# Altium project STM32MP15XXAD_1DDR3Lx16.PrjPcb
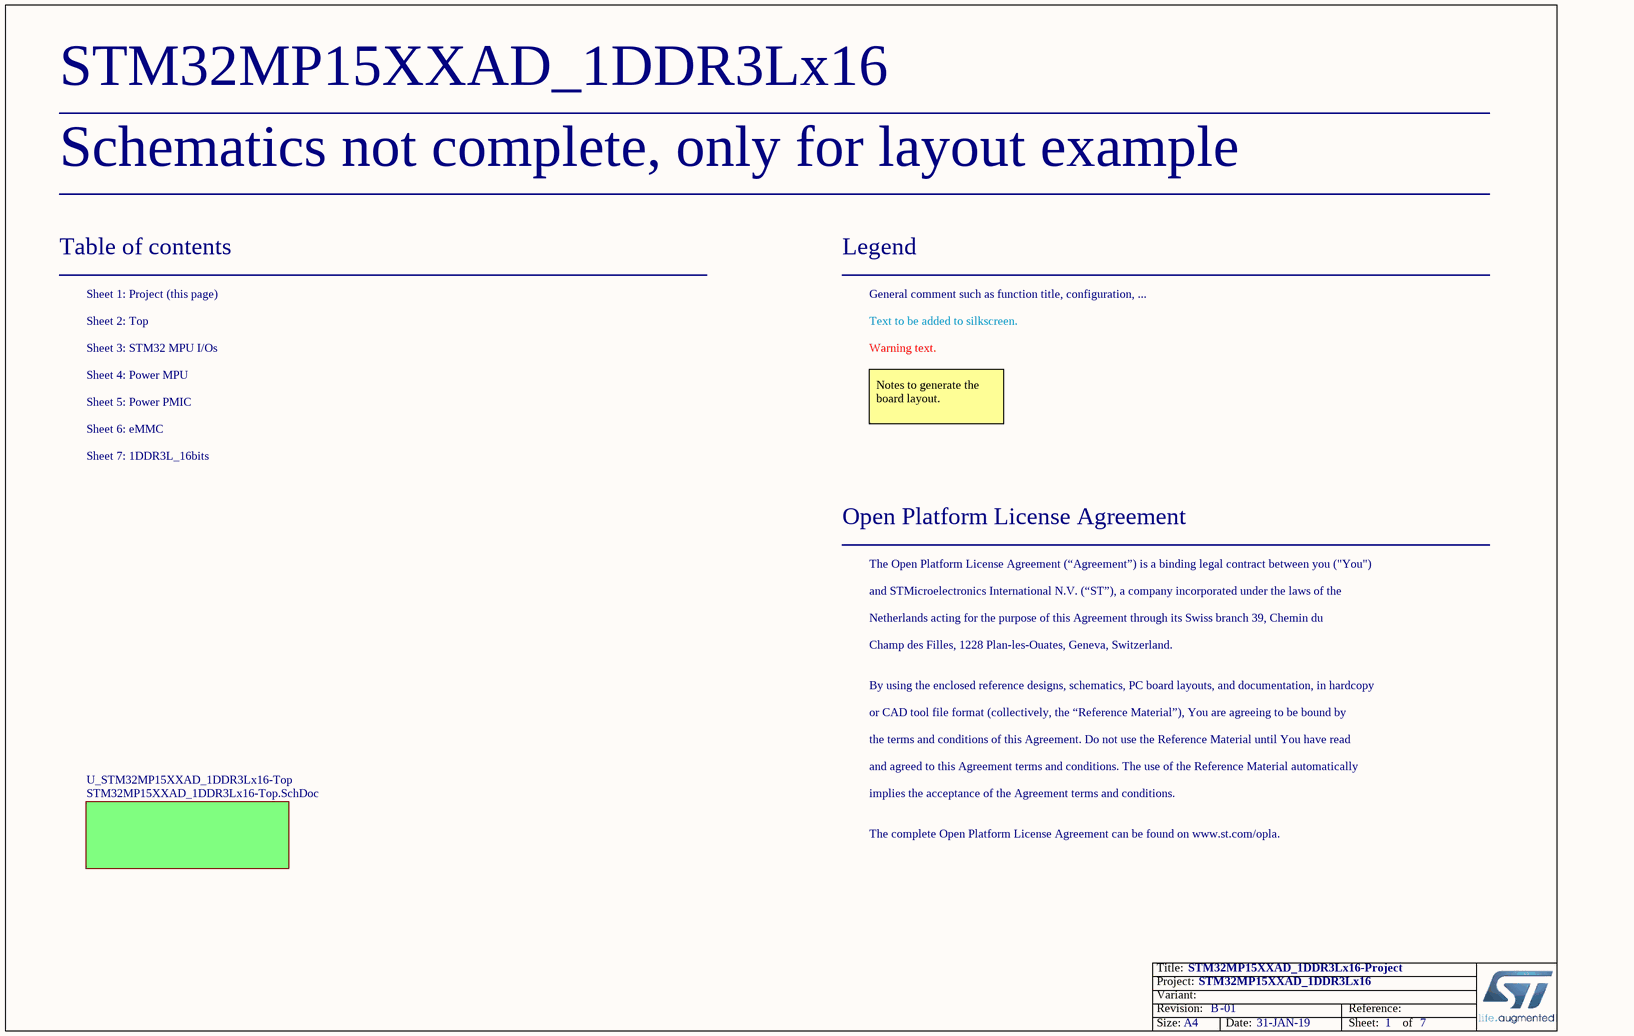
[diagram p0: STM32MP15XXAD_1DDR3Lx16-Project.SchDoc]
Board_Assembly_Revision: 01; Board_Document_Date: 31-JAN-19; Board_Name: STM32MP15XXAD_1DDR3Lx16; Board_PCB_Revision: B
7 sheets, 118 parts. Net scope: flat (ports and power ports of the same name join across sheets).
Board file: STM32MP15XXAD_1DDR3Lx16_B01.PcbDoc
Sheets:
  STM32MP15XXAD_1DDR3Lx16-Project.SchDoc
    U_STM32MP15XXAD_1DDR3Lx16-Top = STM32MP15XXAD_1DDR3Lx16-Top.SchDoc
      U_Power_PMIC = Power_PMIC.SchDoc
      U_Power_MPU = Power_MPU.SchDoc
      U_eMMC = eMMC.SchDoc
      U_1DDR3L_16bits = 1DDR3L_16bits.SchDoc
      U_STM32_MPU_IOs = STM32_MPU_IOs.SchDoc

## Sheet STM32MP15XXAD_1DDR3Lx16-Project.SchDoc: STM32MP15XXAD_1DDR3Lx16-Project
size A4; ApprovedBy: Not used; CheckedBy: Not used; Author: Not used; CompanyName: STMicroelectronics; DrawnBy: Not used; Engineer: Not used; Organization: Not used; Address1: Not used; Address2: Not used; Address3: Not used; Address4: Not used; DocumentNumber: Not used; Revision: Not used; SheetNumber: 1; SheetTotal: 7; CurrentTime: Not used; CurrentDate: Not used; Time: Not used; DocumentFullPathAndName: Not used; DocumentName: Not used; ModifiedDate: Not used; ImagePath: Not used; ProjectName: Not used; Application_BuildNumber: Not used

### Sub-sheets
U_STM32MP15XXAD_1DDR3Lx16-Top = STM32MP15XXAD_1DDR3Lx16-Top.SchDoc: no entries

### Notes on the sheet
- Schematics not complete, only for layout example
- Table of contents
- Sheet 1: Project (this page)
- Legend
- General comment such as function title, configuration, ...
- Sheet 2: Top
- Sheet 3: STM32 MPU I/Os
- Sheet 4: Power MPU
- Text to be added to silkscreen.
- Warning text.
- Sheet 5: Power PMIC
- Sheet 6: eMMC
- Notes to generate the board layout.
- Sheet 7: 1DDR3L_16bits
- Open Platform License Agreement
- The Open Platform License Agreement (“Agreement”) is a binding legal contract between you ("You")
- and STMicroelectronics International N.V. (“ST”), a company incorporated under the laws of the
- Netherlands acting for the purpose of this Agreement through its Swiss branch 39, Chemin du
- Champ des Filles, 1228 Plan-les-Ouates, Geneva, Switzerland.
- By using the enclosed reference designs, schematics, PC board layouts, and documentation, in hardcopy
- or CAD tool file format (collectively, the “Reference Material”), You are agreeing to be bound by
- the terms and conditions of this Agreement. Do not use the Reference Material until You have read
- and agreed to this Agreement terms and conditions. The use of the Reference Material automatically
- implies the acceptance of the Agreement terms and conditions.
- The complete Open Platform License Agreement can be found on www.st.com/opla.
- Title:
- Project:
- Size:
- Revision:
- Variant:
- A4
- -
- Date:
- Reference:
- Sheet:
- of

## Sheet STM32MP15XXAD_1DDR3Lx16-Top.SchDoc: STM32MP15XXAD_1DDR3Lx16-TOP
size A4; Date: Not used; ApprovedBy: Not used; CheckedBy: Not used; Author: Not used; CompanyName: STMicroelectronics; DrawnBy: Not used; Engineer: Not used; Organization: Not used; Address1: Not used; Address2: Not used; Address3: Not used; Address4: Not used; DocumentNumber: Not used; Revision: Not used; SheetNumber: 2; SheetTotal: 7; CurrentTime: Not used; CurrentDate: Not used; Time: Not used; DocumentFullPathAndName: Not used; DocumentName: Not used; ModifiedDate: Not used; ImagePath: Not used; ProjectName: Not used; Application_BuildNumber: Not used
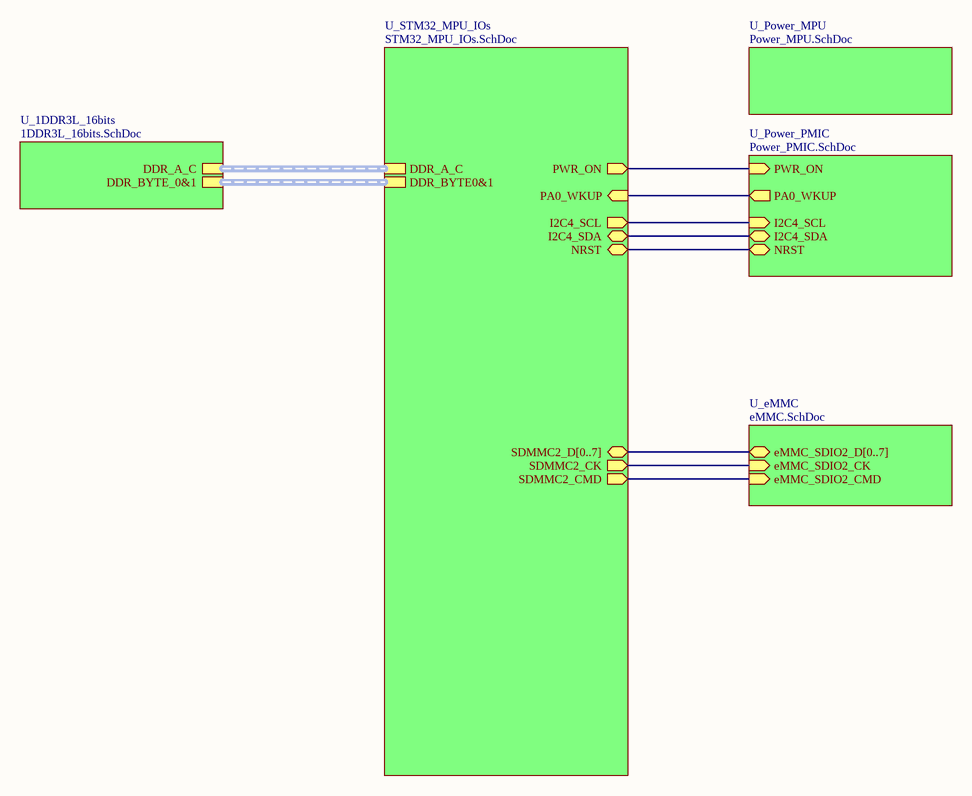
[diagram p1: STM32MP15XXAD_1DDR3Lx16-Top.SchDoc]

### Sub-sheets
U_1DDR3L_16bits = 1DDR3L_16bits.SchDoc: DDR_BYTE_0&1 (harness DDR_BYTE_0&1), DDR_A_C (harness DDR_A_C)
U_eMMC = eMMC.SchDoc: eMMC_SDIO2_CK (in), eMMC_SDIO2_D[0..7] (bidir), eMMC_SDIO2_CMD (in)
U_Power_MPU = Power_MPU.SchDoc: no entries
U_Power_PMIC = Power_PMIC.SchDoc: I2C4_SDA (bidir), I2C4_SCL (in), PA0_WKUP (out), NRST (bidir), PWR_ON (in)
U_STM32_MPU_IOs = STM32_MPU_IOs.SchDoc: PA0_WKUP (in), NRST (bidir), PWR_ON (out), I2C4_SCL (out), I2C4_SDA (bidir), DDR_BYTE0&1 (harness DDR_BYTE_0&1), DDR_A_C (harness DDR_A_C), SDMMC2_D[0..7] (bidir), SDMMC2_CMD (out), SDMMC2_CK (out)

### Nets
(unnamed): sheet U_Power_PMIC/I2C4_SDA, sheet U_STM32_MPU_IOs/I2C4_SDA
(unnamed): sheet U_Power_PMIC/I2C4_SCL, sheet U_STM32_MPU_IOs/I2C4_SCL
(unnamed): sheet U_Power_PMIC/PA0_WKUP, sheet U_STM32_MPU_IOs/PA0_WKUP
(unnamed): sheet U_Power_PMIC/NRST, sheet U_STM32_MPU_IOs/NRST
(unnamed): sheet U_Power_PMIC/PWR_ON, sheet U_STM32_MPU_IOs/PWR_ON
(unnamed): sheet U_eMMC/eMMC_SDIO2_CK, sheet U_STM32_MPU_IOs/SDMMC2_CK
(unnamed): sheet U_eMMC/eMMC_SDIO2_CMD, sheet U_STM32_MPU_IOs/SDMMC2_CMD

### Buses and harness runs
bus sheet U_eMMC/eMMC_SDIO2_D[0..7] = sheet U_STM32_MPU_IOs/SDMMC2_D[0..7]
harness sheet U_1DDR3L_16bits/DDR_A_C = sheet U_STM32_MPU_IOs/DDR_A_C
harness sheet U_1DDR3L_16bits/DDR_BYTE_0&1 = sheet U_STM32_MPU_IOs/DDR_BYTE0&1

### Notes on the sheet
- Title:
- Project:
- Size:
- Revision:
- Variant:
- A4
- -
- Date:
- Reference:
- Sheet:
- of

## Sheet Power_PMIC.SchDoc: Power_PMIC
size A3; CompanyName: STMicroelectronics; Organization: Microcontrollers Division; Address1: 12, Rue Jules HOROWITZ; Address2: 38019 Grenoble; Address3: FRANCE; SheetNumber: 5; SheetTotal: 7
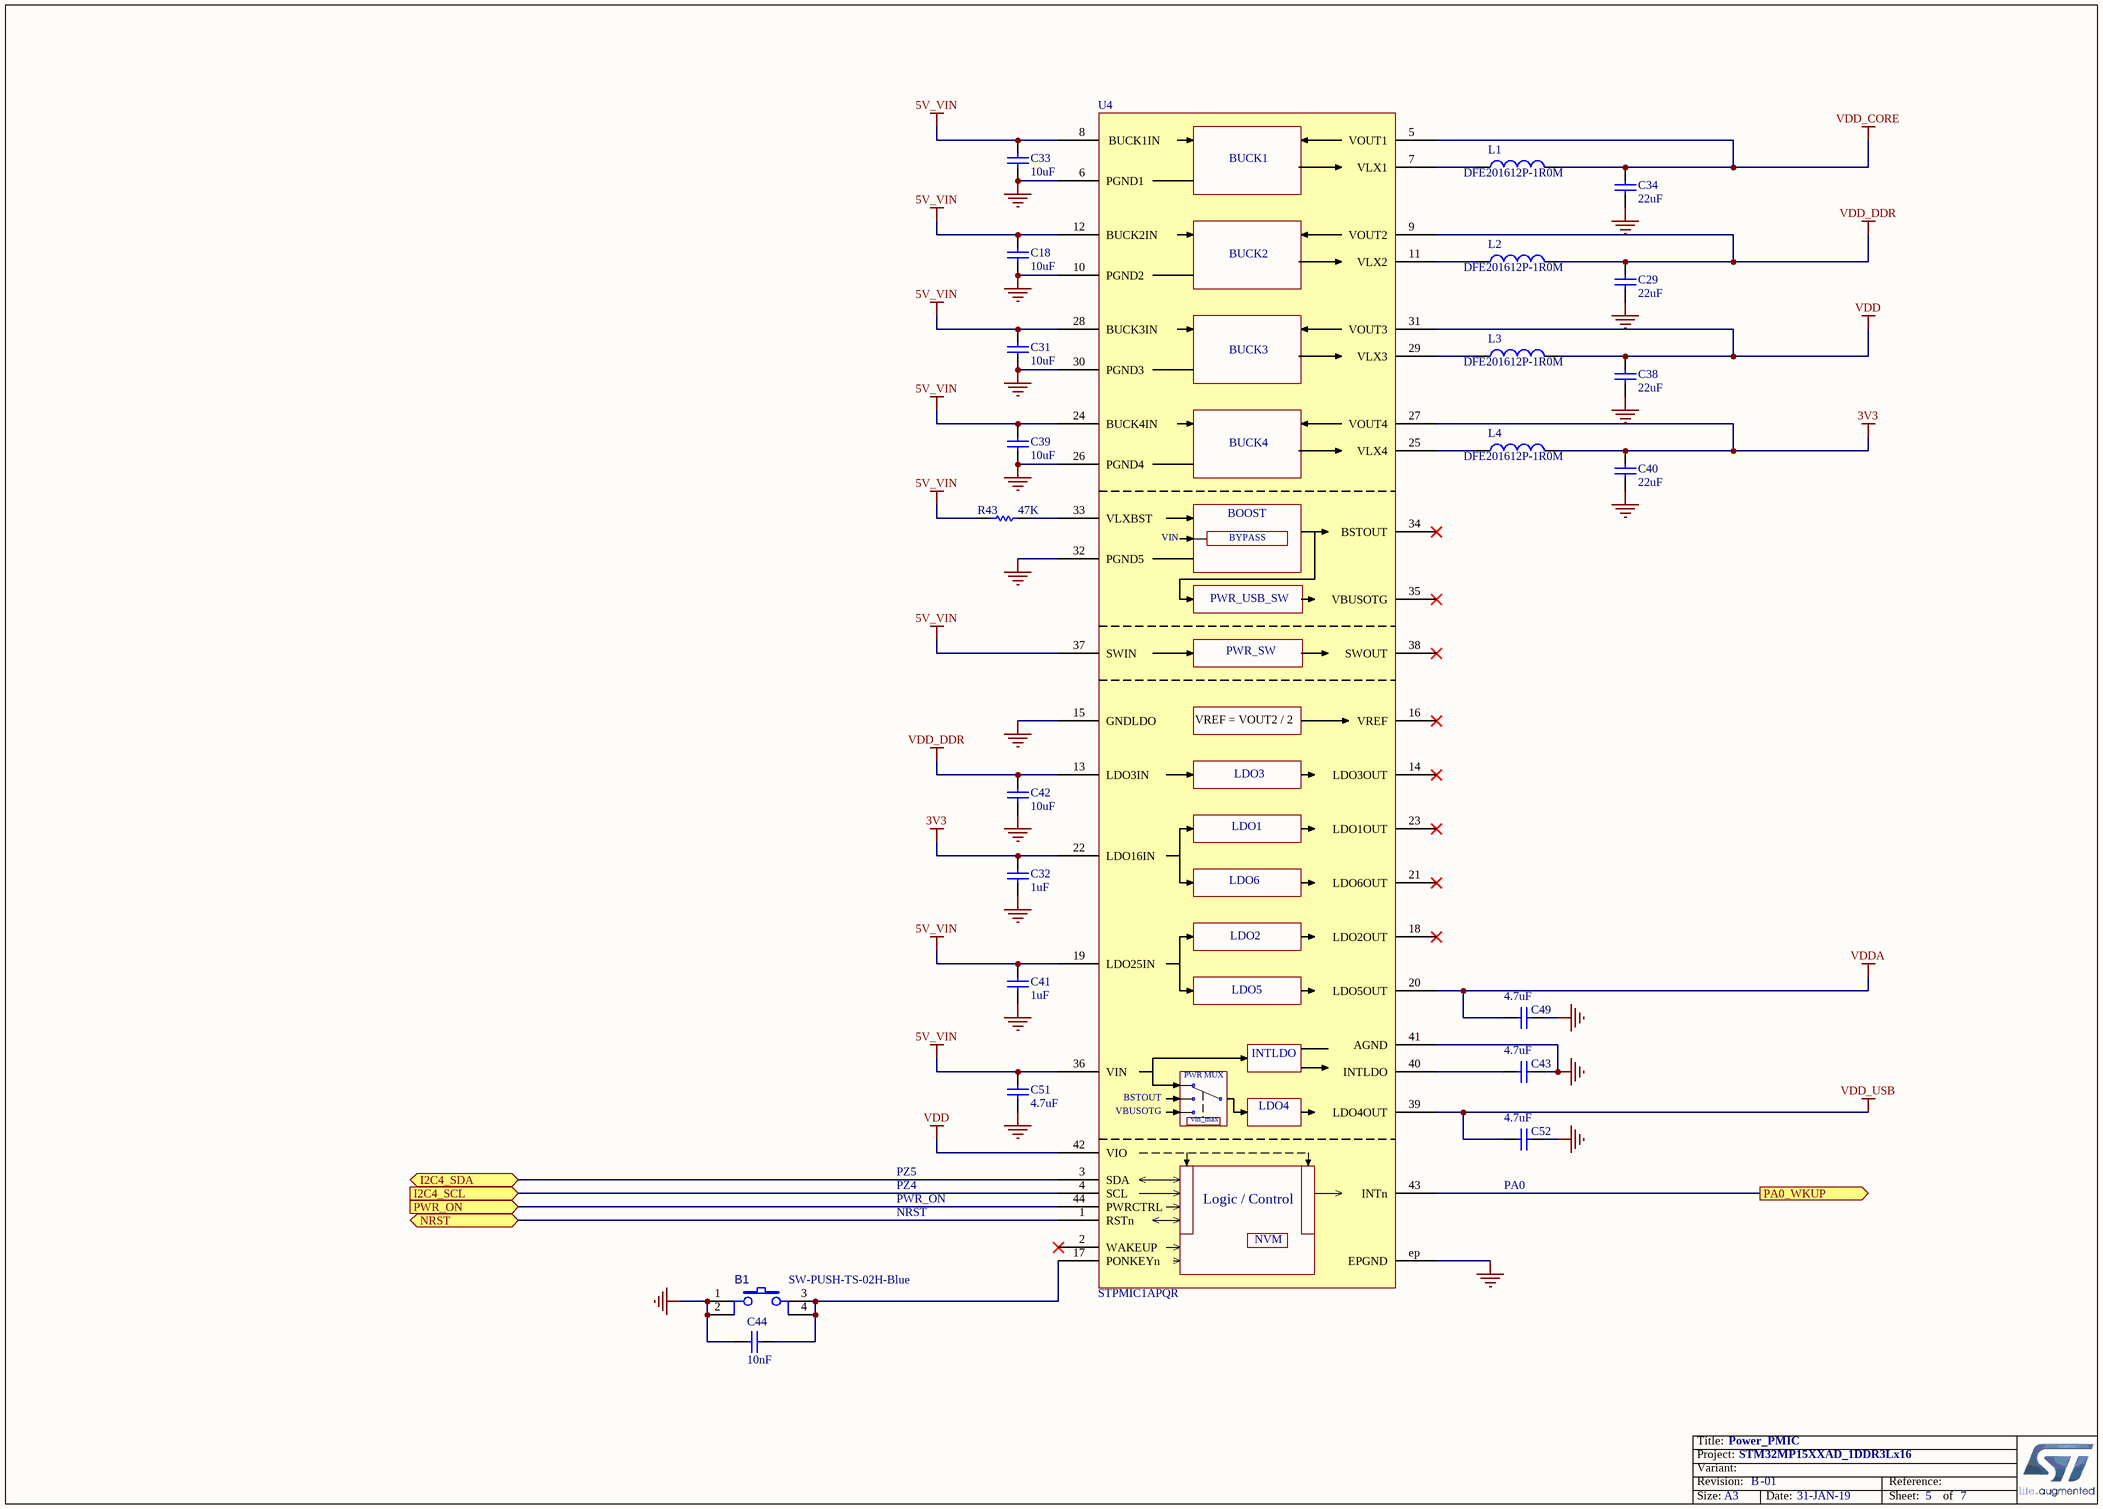
[diagram p2: Power_PMIC.SchDoc]

### Parts
B1  value SW-PUSH-TS-02H-Blue  [SWI_JIUBABA_C-TS-02H-2-5-B-V-T_R_BLUE]
C18  value 10uF  [C0603]
C29  value 22uF  [C0603]
C31  value 10uF  [C0603]
C32  value 1uF  [C0402]
C33  value 10uF  [C0603]
C34  value 22uF  [C0603]
C38  value 22uF  [C0603]
C39  value 10uF  [C0603]
C40  value 22uF  [C0603]
C41  value 1uF  [C0402]
C42  value 10uF  [C0603]
C43  value 4.7uF  [C0402]
C44  value 10nF  [C0402]
C49  value 4.7uF  [C0402]
C51  value 4.7uF  [C0402]
C52  value 4.7uF  [C0402]
L1  value DFE201612P-1R0M  [IND_MURATA_DFE201612P]
L2  value DFE201612P-1R0M  [IND_MURATA_DFE201612P]
L3  value DFE201612P-1R0M  [IND_MURATA_DFE201612P]
L4  value DFE201612P-1R0M  [IND_MURATA_DFE201612P]
R43  value 47K  [R0402]
U4  value STPMIC1APQR  [ICC_WFQFN44-EPAD_5X6_P040]

### Ports
I2C4_SCL (in), I2C4_SDA (bidir), NRST (bidir), PA0_WKUP (out), PWR_ON (in)

### Nets
3V3: C32.2 C40.2 L4.2 U4.22(LDO16IN) U4.27(VOUT4)
5V_VIN: C18.2 C31.2 C33.2 C39.2 C41.2 C51.1 R43.2 U4.8(BUCK1IN) U4.12(BUCK2IN) U4.19(LDO25IN) U4.24(BUCK4IN) U4.28(BUCK3IN) U4.36(VIN) U4.37(SWIN)
GND: B1.1 B1.2 C18.1 C29.1 C31.1 C32.1 C33.1 C34.1 C38.1 C39.1 C40.1 C41.1 C42.1 C43.1 C44.1 C49.1 C51.2 C52.1 U4.6(PGND1) U4.10(PGND2) U4.15(GNDLDO) U4.26(PGND4) U4.30(PGND3) U4.32(PGND5) U4.41(AGND) U4.ep(EPGND)
VDD: C38.2 L3.2 U4.31(VOUT3) U4.42(VIO)
VDD_CORE: C34.2 L1.2 U4.5(VOUT1)
VDD_DDR: C29.2 C42.2 L2.2 U4.9(VOUT2) U4.13(LDO3IN)
VDD_USB: C52.2 U4.39(LDO4OUT)
VDDA: C49.2 U4.20(LDO5OUT)
I2C4_SCL: U4.4(SCL) ; port I2C4_SCL
I2C4_SDA: U4.3(SDA) ; port I2C4_SDA
NRST: U4.1(RSTn) ; port NRST
PA0_WKUP: U4.43(INTn) ; port PA0_WKUP
PWR_ON: U4.44(PWRCTRL) ; port PWR_ON
NetB1_3: B1.3 B1.4 C44.2 U4.17(PONKEYn)
NetC43_2: C43.2 U4.40(INTLDO)
NetL1_1: L1.1 U4.7(VLX1)
NetL2_1: L2.1 U4.11(VLX2)
NetL3_1: L3.1 U4.29(VLX3)
NetL4_1: L4.1 U4.25(VLX4)
NetR43_1: R43.1 U4.33(VLXBST)

Not connected (* = marked no-connect by the designer): U4 2(WAKEUP)* 14(LDO3OUT)* 16(VREF)* 18(LDO2OUT)* 21(LDO6OUT)* 23(LDO1OUT)* 34(BSTOUT)* 35(VBUSOTG)* 38(SWOUT)*

### Notes on the sheet
- PZ5
- PZ4
- (near C52) PA0
- NRST
- PWR_ON
- Title:
- Project:
- Size:
- Revision:
- Variant:
- A3
- -
- Date:
- Reference:
- Sheet:
- of
- (in symbol MCD-01650) BUCK1; BUCK2; BUCK3; BUCK4; BOOST; BYPASS; PWR_USB_SW; PWR_SW; VREF = VOUT2 / 2; LDO3; LDO1; LDO6; LDO2; LDO5; PWR MUX; LDO4; vin_max; Logic / Control; NVM

### Library data of the parts
B1 = MCD-00172: Switch HW SMD blue; Part_Type: Misc; Manufacturer_Part_Number: C-TS-02H-2.5-B-V-T/R BLUE; Manufacturer: JIUBABA; Provided_By: SUBCO; Internal_Part_Number: MCD-00172; Status: Checked; ComponentLink1Description: Datasheet; ComponentLink1URL: http://tunmcdsvn.tun.st.com/Component_Datasheet_Library/Trunk/Misc/Jiubaba_TS-02H-H2-5; ECCN_US: n/a; ECCN_EU: n/a
C18 C31 C33 C39 C42 = MCD-00099: Capacitor, MLCC, 10uF, 10V, X5R, 10%, 0603, T=0,8mm; Manufacturer_Part_Number: GRM188R61A106KE69D; Manufacturer: MURATA; Provided_By: SUBCO; ECCN_US: EAR99; ECCN_EU: NEC; Internal_Part_Number: MCD-00099; Status: Released; Part_Type: Capacitor; Package: C0603; ComponentLink1Description: Datasheet; ComponentLink1URL: http://tunmcdsvn.tun.st.com/Component_Datasheet_Library/Trunk/Capacitors/Murata_Capacitor_GR_series
C29 C34 C38 C40 = MCD-00100: Capacitor, MLCC, 22uF, 6V3, X5R, 20%, 0603, T=0,8mm; Manufacturer_Part_Number: GRM188R60J226MEA0J; Manufacturer: MURATA; Provided_By: SUBCO; ECCN_US: EAR99; ECCN_EU: NEC; Internal_Part_Number: MCD-00100; Status: Released; Part_Type: Capacitor; Package: C0603; ComponentLink1Description: Datasheet; ComponentLink1URL: http://tunmcdsvn.tun.st.com/Component_Datasheet_Library/Trunk/Capacitors/Murata_Capacitor_GR_series
C32 C41 = MCD-00095: Capacitor, MLCC, 1uF, 6V3, X5R, 10%, 0402, T=0,5mm; Manufacturer_Part_Number: GRM155R61E105KA12; Manufacturer: MURATA; Alternate_Manufacturer_Part_Number: GRM155R60J105KE19; Provided_By: SUBCO; ECCN_US: EAR99; ECCN_EU: NEC; Internal_Part_Number: MCD-00095; Status: Released; Part_Type: Capacitor; Package: C0402; ComponentLink1Description: Datasheet; ComponentLink1URL: http://tunmcdsvn.tun.st.com/Component_Datasheet_Library/Trunk/Capacitors/Murata_Capacitor_GR_series; Alternate_Manufacturer: MURATA
C43 C49 C51 C52 = MCD-01356: Capacitor, MLCC, 4.7uF, 6V3, X5R, 20%, 0402, T=0,5mm; Manufacturer_Part_Number: GRM155R60J475ME47; Manufacturer: MURATA; Provided_By: SUBCO; ECCN_US: EAR99; ECCN_EU: NEC; Internal_Part_Number: MCD-01356; Status: Released; Part_Type: Capacitor; Package: C0402; ComponentLink1Description: Datasheet; ComponentLink1URL: http://tunmcdsvn.tun.st.com/Component_Datasheet_Library/Trunk/Capacitors/Murata_Capacitor_GR_series
C44 = MCD-00011: Capacitor, MLCC, 10nF, 16V, X7R, 10%, 0402, T=0.5mm; Manufacturer_Part_Number: CC0402KRX7R7BB103; Manufacturer: YAGEO; Provided_By: SUBCO; ECCN_US: EAR99; ECCN_EU: NEC; Internal_Part_Number: MCD-00011; Status: Released; Part_Type: Capacitor; Package: C0402; ComponentLink1Description: Datasheet; ComponentLink1URL: http://tunmcdsvn.tun.st.com/Component_Datasheet_Library/Trunk/Capacitors/Yageo_Multilayer_Capacitor_X7R_series_100pF_to_22uF
L1-L4 = MCD-01491: Inductors 1.0uH 54mOhms3.3A +/-20% 2016; Manufacturer: MURATA; Provided_By: SUBCO; Internal_Part_Number: MCD-01491; Status: Footprint available; Part_Type: Inductor; Manufacturer_Part_Number: DFE201612P-1R0M; Package: 2016; ComponentLink1Description: Datasheet; ComponentLink1URL: http://tunmcdsvn.tun.st.com/Component_Datasheet_Library/Trunk/Inductors/Murata_Inductor_DFE201612P-1ROM/Murata_inductor_DFE201612P-1R0M.pdf; ECCN_US: n/a; ECCN_EU: n/a
R43 = MCD-00063: Resistor,47K,0402,1%,1/16W; Manufacturer_Part_Number: RC0402FR-0747KL; Manufacturer: YAGEO; Provided_By: SUBCO; ECCN_US: EAR99; ECCN_EU: NEC; Internal_Part_Number: MCD-00063; Status: Released; Part_Type: Resistor; Package: R0402; ComponentLink1Description: Datasheet; ComponentLink1URL: http://tunmcdsvn.tun.st.com/Component_Datasheet_Library/Trunk/Resistors/Yageo_Resistor_RC0402-series
U4 = MCD-01650: ST PMIC:  4 step-down + 1 advanced boost SMPS, 6 LDOs, 2 pwr switches, DDR Vref, NVM option 'A' for IO@3.3V; Part_Type: IC; Manufacturer: STMICROELECTRONICS; ECCN_US: EAR99; ECCN_EU: NEC; Provided_By: SUBCO with ST control; Internal_Part_Number: MCD-01650; Status: Footprint available; Manufacturer_Part_Number: STPMIC1APQR; Package: WFQFN 5.0x6.0x0.80mm; ComponentLink1Description: Datasheet; ComponentLink1URL: http://tunmcdsvn.tun.st.com/Component_Datasheet_Library/Trunk/IC/STM_PMIC_LuftBurg_5x6_44L_20_01_2016

## Sheet Power_MPU.SchDoc: Power_MPU
size A3; CompanyName: STMicroelectronics; SheetNumber: 4; SheetTotal: 7
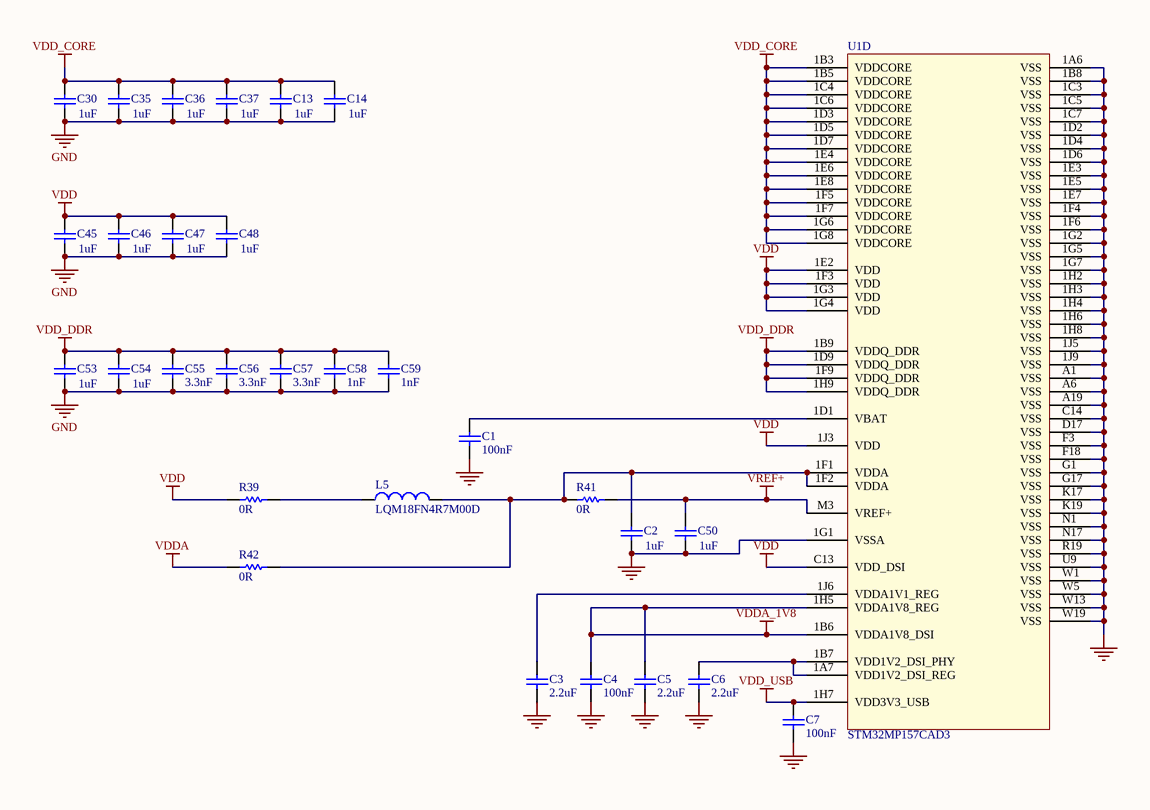
[diagram p3: Power_MPU.SchDoc]

### Parts
C1  value 100nF  [C0402]
C2  value 1uF  [C0402]
C3  value 2.2uF  [C0402]  (hidden comment: Capacitor)
C4  value 100nF  [C0402]
C5  value 2.2uF  [C0402]  (hidden comment: Capacitor)
C6  value 2.2uF  [C0402]  (hidden comment: Capacitor)
C7  value 100nF  [C0402]
C13  value 1uF  [C0402]
C14  value 1uF  [C0402]
C30  value 1uF  [C0402]
C35  value 1uF  [C0402]
C36  value 1uF  [C0402]
C37  value 1uF  [C0402]
C45  value 1uF  [C0402]
C46  value 1uF  [C0402]
C47  value 1uF  [C0402]
C48  value 1uF  [C0402]
C50  value 1uF  [C0402]
C53  value 1uF  [C0402]
C54  value 1uF  [C0402]
C55  value 3.3nF  [C0402]  (hidden comment: Capacitor)
C56  value 3.3nF  [C0402]  (hidden comment: Capacitor)
C57  value 3.3nF  [C0402]  (hidden comment: Capacitor)
C58  value 1nF  [C0402]
C59  value 1nF  [C0402]
L5  value LQM18FN4R7M00D  [L0603_H0P8]
R39  value 0R  [R0402]
R41  value 0R  [R0402]
R42  value 0R  [R0402]
U1  value STM32MP157CAD3  [ICC_TFBGA257_10X10_STM32MP157CAD3_P050-065]  (part D of 5)

### Nets
GND: C1.1 C2.1 C3.1 C4.1 C5.1 C6.1 C7.1 C13.1 C14.1 C30.1 C35.1 C36.1 C37.1 C45.1 C46.1 C47.1 C48.1 C50.1 C53.1 C54.1 C55.1 C56.1 C57.1 C58.1 C59.1 U1.1A6(VSS) U1.1B8(VSS) U1.1C3(VSS) U1.1C5(VSS) U1.1C7(VSS) U1.1D2(VSS) U1.1D4(VSS) U1.1D6(VSS) U1.1E3(VSS) U1.1E5(VSS) U1.1E7(VSS) U1.1F4(VSS) U1.1F6(VSS) U1.1G1(VSSA) U1.1G2(VSS) U1.1G5(VSS) U1.1G7(VSS) U1.1H2(VSS) U1.1H3(VSS) U1.1H4(VSS) U1.1H6(VSS) U1.1H8(VSS) U1.1J5(VSS) U1.1J9(VSS) U1.A1(VSS) U1.A6(VSS) U1.A19(VSS) U1.C14(VSS) U1.D17(VSS) U1.F3(VSS) U1.F18(VSS) U1.G1(VSS) U1.G17(VSS) U1.K17(VSS) U1.K19(VSS) U1.N1(VSS) U1.N17(VSS) U1.R19(VSS) U1.U9(VSS) U1.W1(VSS) U1.W5(VSS) U1.W13(VSS) U1.W19(VSS)
VDD: C45.2 C46.2 C47.2 C48.2 R39.1 U1.1E2(VDD) U1.1F3(VDD) U1.1G3(VDD) U1.1G4(VDD) U1.1J3(VDD) U1.C13(VDD_DSI)
VDD_CORE: C13.2 C14.2 C30.2 C35.2 C36.2 C37.2 U1.1B3(VDDCORE) U1.1B5(VDDCORE) U1.1C4(VDDCORE) U1.1C6(VDDCORE) U1.1D3(VDDCORE) U1.1D5(VDDCORE) U1.1D7(VDDCORE) U1.1E4(VDDCORE) U1.1E6(VDDCORE) U1.1E8(VDDCORE) U1.1F5(VDDCORE) U1.1F7(VDDCORE) U1.1G6(VDDCORE) U1.1G8(VDDCORE)
VDD_DDR: C53.2 C54.2 C55.2 C56.2 C57.2 C58.2 C59.2 U1.1B9(VDDQ_DDR) U1.1D9(VDDQ_DDR) U1.1F9(VDDQ_DDR) U1.1H9(VDDQ_DDR)
VDD_USB: C7.2 U1.1H7(VDD3V3_USB)
VDDA: R42.1
VDDA_1V8: C4.2 C5.2 U1.1B6(VDDA1V8_DSI) U1.1H5(VDDA1V8_REG)
VREF+: C50.2 R41.2 U1.M3(VREF+)
NetC1_2: C1.2 U1.1D1(VBAT)
NetC2_2: C2.2 L5.2 R41.1 R42.2 U1.1F1(VDDA) U1.1F2(VDDA)
NetC3_2: C3.2 U1.1J6(VDDA1V1_REG)
NetC6_2: C6.2 U1.1A7(VDD1V2_DSI_REG) U1.1B7(VDD1V2_DSI_PHY)
NetL5_1: L5.1 R39.2

### Notes on the sheet
- Title:
- Project:
- Size:
- Revision:
- Variant:
- A3
- -
- Date:
- Reference:
- Sheet:
- of

### Library data of the parts
C1 C4 C7 = MCD-00006: Capacitor, MLCC, 100nF, 16V, X7R, 10%, 0402, T=0.5mm; Manufacturer_Part_Number: CC0402KRX7R7BB104; Manufacturer: YAGEO; Alternate_Manufacturer_Part_Number: GCM155R71C104KA55D; Alternate_Manufacturer: MURATA; Provided_By: SUBCO; ECCN_US: EAR99; ECCN_EU: NEC; Internal_Part_Number: MCD-00006; Status: Released; Part_Type: Capacitor; Package: C0402; ComponentLink1Description: Datasheet; ComponentLink1URL: http://tunmcdsvn.tun.st.com/Component_Datasheet_Library/Trunk/Capacitors/Yageo_Multilayer_Capacitor_X7R_series_100pF_to_22uF
C2 C13 C14 C30 C35-C37 C45-C48 C50 C53 C54 = MCD-00095: as C32 on sheet Power_PMIC; Internal_Part_Number: MCD-00095; Status: Released; Package: C0402; ComponentLink1Description: Datasheet; ComponentLink1URL: http://tunmcdsvn.tun.st.com/Component_Datasheet_Library/Trunk/Capacitors/Murata_Capacitor_GR_series; Part_Type: Capacitor; Alternate_Manufacturer: MURATA
C3 C5 C6 = MCD-01823: Capacitor,MLCC,2.2uF,6V3,X5R,10%,0402,T=0.5; Manufacturer_Part_Number: GRM155R60J225KE95D; Manufacturer: MURATA; ECCN_US: EAR99; ECCN_EU: NEC; Provided_By: SUBCO; Internal_Part_Number: MCD-01823; Status: Checked; Part_Type: Capacitor; Package: C0402; ComponentLink1Description: Datasheet; ComponentLink1URL: http://tunmcdsvn.tun.st.com/Component_Datasheet_Library/Trunk/Capacitors/Murata_Capacitor_GR_series
C55-C57 = MCD-01462: Capacitor, MLCC, 3.3nF, 16V, X7R, 10%, 0402, T=0.5mm; Manufacturer_Part_Number: CC0402KRX7R7BB332; Manufacturer: YAGEO; Provided_By: SUBCO; Internal_Part_Number: MCD-01462; Status: Footprint available; Part_Type: Capacitor; Package: C0402; ComponentLink1Description: Datasheet; ComponentLink1URL: http://tunmcdsvn.tun.st.com/Component_Datasheet_Library/Trunk/Capacitors/Yageo_Multilayer_Capacitor_X7R_series_100pF_to_22uF/Yageo_Mutilayer_Capacitor_X7R_100pF_to_22uF.pdf; ECCN_US: N/A; ECCN_EU: N/A
C58 C59 = MCD-00198: Capacitor, MLCC, 1nF, 16V, X7R, 10%, 0402, T=0.5mm; Manufacturer_Part_Number: CC0402KRX7R7BB102; Manufacturer: YAGEO; Provided_By: SUBCO; ECCN_US: EAR99; ECCN_EU: NEC; Internal_Part_Number: MCD-00198; Status: Released; Part_Type: Capacitor; Package: C0402; ComponentLink1Description: Datasheet; ComponentLink1URL: http://tunmcdsvn.tun.st.com/Component_Datasheet_Library/Trunk/Capacitors/Yageo_Multilayer_Capacitor_X7R_series_100pF_to_22uF
L5 = MCD-01134: IND 4.7uH 20% 80mA 600mhom 0603; Part_Type: Inductor; Manufacturer: MURATA; Provided_By: SUBCO; Internal_Part_Number: MCD-01134; Status: Footprint available; Manufacturer_Part_Number: LQM18FN4R7M00D; Package: 0603; ComponentLink1Description: Datasheet; ComponentLink1URL: http://tunmcdsvn.tun.st.com/Component_Datasheet_Library/Trunk/Inductors/Murata_inductor_LQM18FN4R7M00D; ECCN_US: n/a; ECCN_EU: n/a
R39 R41 R42 = MCD-00052: Resistor,0R,0402,5%,1/16W; Manufacturer_Part_Number: RC0402JR-070RL; Manufacturer: YAGEO; Provided_By: SUBCO; ECCN_US: EAR99; ECCN_EU: NEC; Internal_Part_Number: MCD-00052; Status: Released; Part_Type: Resistor; Package: R0402; ComponentLink1Description: Datasheet; ComponentLink1URL: http://tunmcdsvn.tun.st.com/Component_Datasheet_Library/Trunk/Resistors/Yageo_Resistor_RC0402-series
U1 = MCD-01144: MPU TFBGA10x10 secure boot+crypto; Part_Type: IC; Manufacturer: STMICROELECTRONICS; ECCN_US: 5A002A4; Provided_By: SUBCO with ST control; Internal_Part_Number: MCD-01144; Status: Footprint available; Manufacturer_Part_Number: STM32MP157CAD3; ComponentLink1Description: Datasheet; ComponentLink1URL: http://TBD; ECCN_EU: 5A002A4

## Sheet eMMC.SchDoc: eMMC
size A3; CompanyName: STMicroelectronics; Address1: 12, Rue Jules HOROWITZ; Address2: 38019 Grenoble; Address3: FRANCE; SheetNumber: 6; SheetTotal: 7
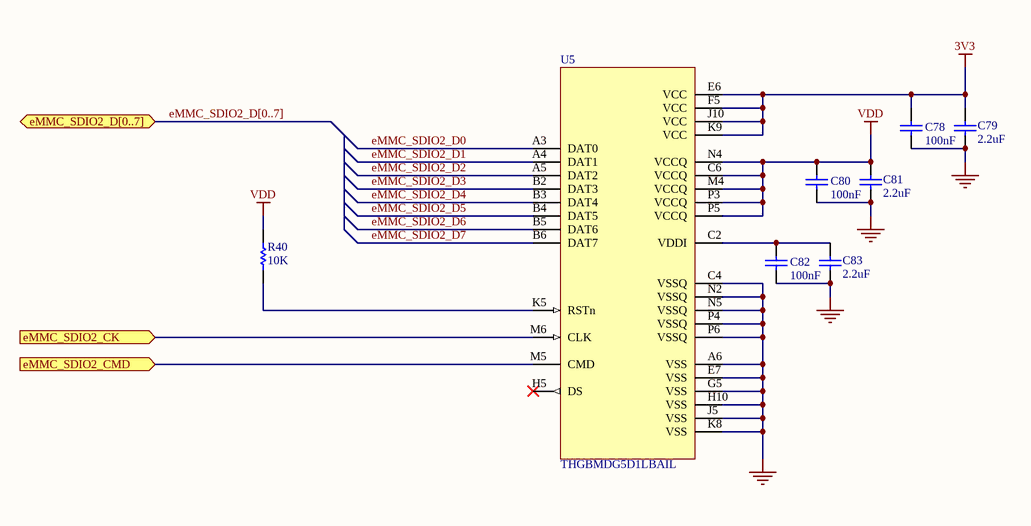
[diagram p4: eMMC.SchDoc]

### Parts
C78  value 100nF  [C0402]
C79  value 2.2uF  [C0603]
C80  value 100nF  [C0402]
C81  value 2.2uF  [C0603]
C82  value 100nF  [C0402]
C83  value 2.2uF  [C0603]
R40  value 10K  [R0402]
U5  value THGBMDG5D1LBAIL  [ICC_P-WFBGA153_13X11P5_P050]

### Ports
eMMC_SDIO2_CK (in), eMMC_SDIO2_CMD (in), eMMC_SDIO2_D[0..7] (bidir)

### Nets
3V3: C78.2 C79.2 U5.E6(VCC) U5.F5(VCC) U5.J10(VCC) U5.K9(VCC)
GND: C78.1 C79.1 C80.1 C81.1 C82.1 C83.1 U5.A6(VSS) U5.C4(VSSQ) U5.E7(VSS) U5.G5(VSS) U5.H10(VSS) U5.J5(VSS) U5.K8(VSS) U5.N2(VSSQ) U5.N5(VSSQ) U5.P4(VSSQ) U5.P6(VSSQ)
VDD: C80.2 C81.2 R40.2 U5.C6(VCCQ) U5.M4(VCCQ) U5.N4(VCCQ) U5.P3(VCCQ) U5.P5(VCCQ)
eMMC_SDIO2_CK: U5.M6(CLK) ; port eMMC_SDIO2_CK
eMMC_SDIO2_CMD: U5.M5(CMD) ; port eMMC_SDIO2_CMD
eMMC_SDIO2_D0: U5.A3(DAT0)
eMMC_SDIO2_D1: U5.A4(DAT1)
eMMC_SDIO2_D2: U5.A5(DAT2)
eMMC_SDIO2_D3: U5.B2(DAT3)
eMMC_SDIO2_D4: U5.B3(DAT4)
eMMC_SDIO2_D5: U5.B4(DAT5)
eMMC_SDIO2_D6: U5.B5(DAT6)
eMMC_SDIO2_D7: U5.B6(DAT7)
NetC82_2: C82.2 C83.2 U5.C2(VDDI)
NetR40_1: R40.1 U5.K5(RSTn)

Not connected (* = marked no-connect by the designer): U5 H5(DS)*

### Buses and harness runs
bus eMMC_SDIO2_D[0..7] = port eMMC_SDIO2_D[0..7]

### Notes on the sheet
- Title:
- Project:
- Size:
- Revision:
- Variant:
- A3
- -
- Date:
- Reference:
- Sheet:
- of

### Library data of the parts
C78 C80 C82 = MCD-00006: as C1 on sheet Power_MPU; Internal_Part_Number: MCD-00006; Status: Released; Part_Type: Capacitor; Package: C0402; ComponentLink1Description: Datasheet; ComponentLink1URL: http://tunmcdsvn.tun.st.com/Component_Datasheet_Library/Trunk/Capacitors/Yageo_Multilayer_Capacitor_X7R_series_100pF_to_22uF
C79 C81 C83 = MCD-00012: Capacitor, MLCC, 2.2uF, 10V, X5R, 10%, 0603, T=0,8mm; Manufacturer_Part_Number: CC0603KRX5R6BB225; Manufacturer: YAGEO; Alternate_Manufacturer_Part_Number: C0603C225K8PACTU; Alternate_Manufacturer: KEMET; Provided_By: SUBCO; ECCN_US: EAR99; ECCN_EU: NEC; Internal_Part_Number: MCD-00012; Status: Released; Part_Type: Capacitor; Package: C0603; ComponentLink1Description: Datasheet; ComponentLink1URL: http://tunmcdsvn.tun.st.com/Component_Datasheet_Library/Trunk/Capacitors/Yageo_Multilayer_capacitor_X5R_series_100pF_to_100uF
R40 = MCD-00053: Resistor,10K,0402,1%,1/16W; Manufacturer_Part_Number: RC0402FR-0710KL; Manufacturer: YAGEO; Provided_By: SUBCO; ECCN_US: EAR99; ECCN_EU: NEC; Internal_Part_Number: MCD-00053; Status: Released; Part_Type: Resistor; Package: R0402; ComponentLink1Description: Datasheet; ComponentLink1URL: http://tunmcdsvn.tun.st.com/Component_Datasheet_Library/Trunk/Resistors/Yageo_Resistor_RC0402-series
U5 = MCD-00110: Memory,e-MMC,4GB,3V3,WFBGA,153pins; Part_Type: IC; Manufacturer: TOSHIBA; Provided_By: SUBCO; ECCN_US: 3A991; ECCN_EU: NEC; Internal_Part_Number: MCD-00110; Status: Released; Manufacturer_Part_Number: THGBMDG5D1LBAIL; ComponentLink1Description: Datasheet; ComponentLink1URL: http://tunmcdsvn.tun.st.com/Component_Datasheet_Library/Trunk/IC/Toshiba_eMMC_THGBMDG5D1LBAIL_20151201

## Sheet 1DDR3L_16bits.SchDoc: 1DDR3L_16bits
size A3; Date: Not used; ApprovedBy: Not used; CheckedBy: Not used; Author: Not used; CompanyName: STMicroelectronics; DrawnBy: Not used; Engineer: Not used; Organization: Not used; Address1: Not used; Address2: Not used; Address3: Not used; Address4: Not used; DocumentNumber: Not used; Revision: Not used; SheetNumber: 7; SheetTotal: 7; CurrentTime: Not used; CurrentDate: Not used; Time: Not used; DocumentFullPathAndName: Not used; DocumentName: Not used; ModifiedDate: Not used; ImagePath: Not used; Application_BuildNumber: Not used
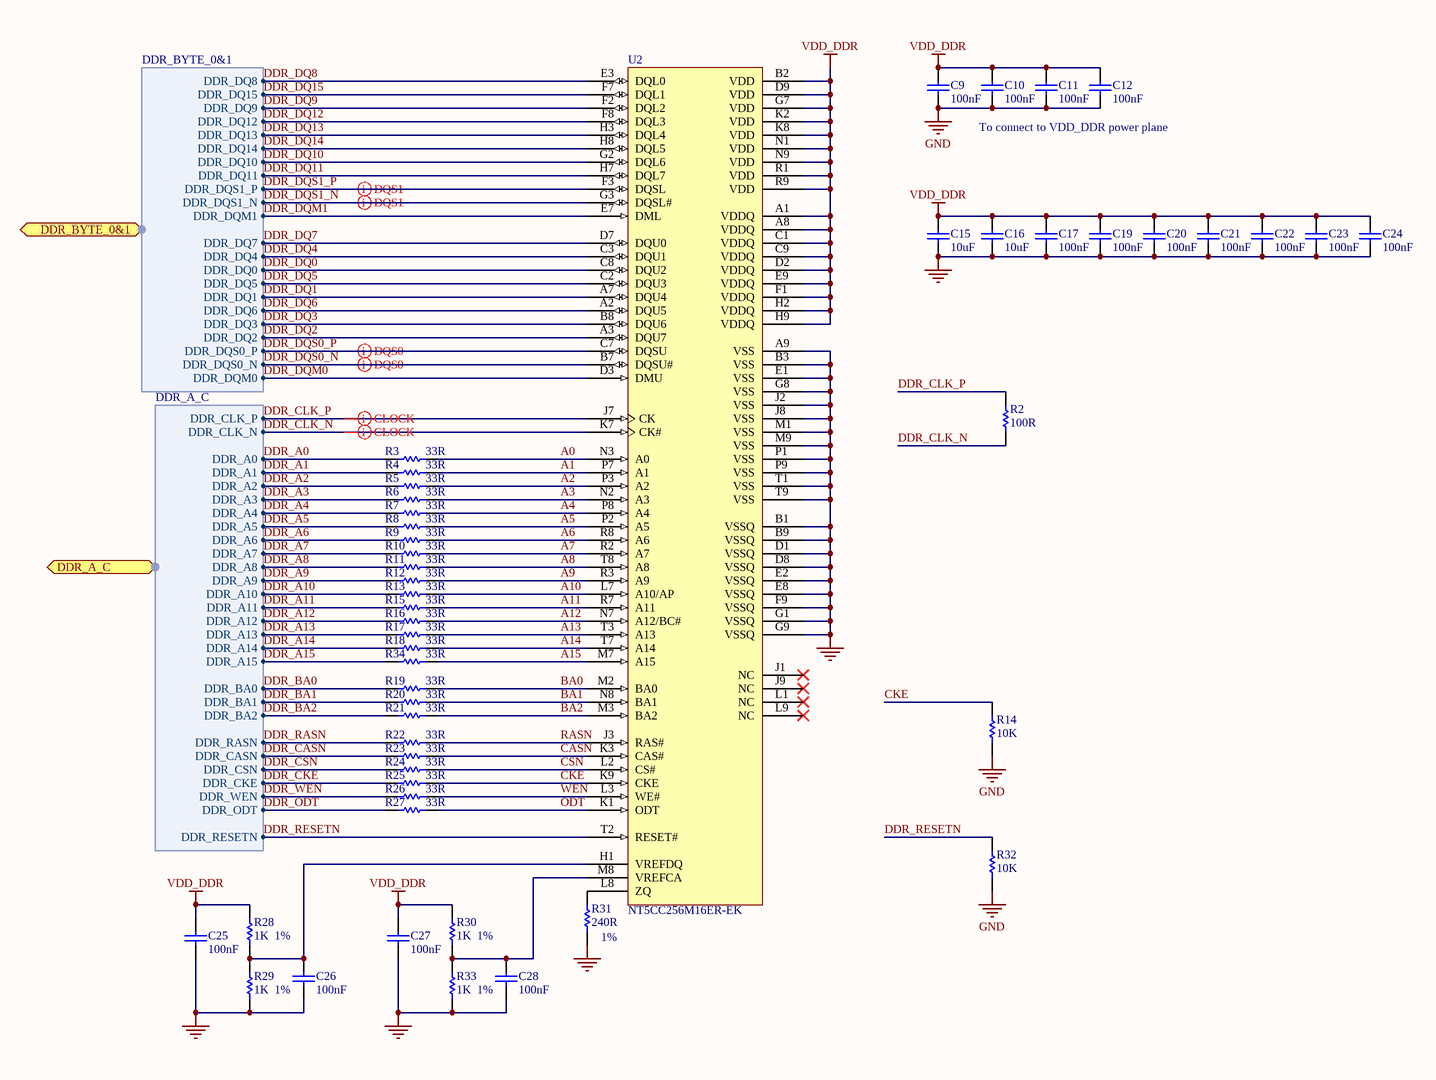
[diagram p5: 1DDR3L_16bits.SchDoc]

### Parts
C9  value 100nF  [C0402]
C10  value 100nF  [C0402]
C11  value 100nF  [C0402]
C12  value 100nF  [C0402]
C15  value 10uF  [C0603]
C16  value 10uF  [C0603]
C17  value 100nF  [C0402]
C19  value 100nF  [C0402]
C20  value 100nF  [C0402]
C21  value 100nF  [C0402]
C22  value 100nF  [C0402]
C23  value 100nF  [C0402]
C24  value 100nF  [C0402]
C25  value 100nF  [C0402]
C26  value 100nF  [C0402]
C27  value 100nF  [C0402]
C28  value 100nF  [C0402]
R2  value 100R  [R0402]
R3  value 33R  [R0402]
R4  value 33R  [R0402]
R5  value 33R  [R0402]
R6  value 33R  [R0402]
R7  value 33R  [R0402]
R8  value 33R  [R0402]
R9  value 33R  [R0402]
R10  value 33R  [R0402]
R11  value 33R  [R0402]
R12  value 33R  [R0402]
R13  value 33R  [R0402]
R14  value 10K  [R0402]
R15  value 33R  [R0402]
R16  value 33R  [R0402]
R17  value 33R  [R0402]
R18  value 33R  [R0402]
R19  value 33R  [R0402]
R20  value 33R  [R0402]
R21  value 33R  [R0402]
R22  value 33R  [R0402]
R23  value 33R  [R0402]
R24  value 33R  [R0402]
R25  value 33R  [R0402]
R26  value 33R  [R0402]
R27  value 33R  [R0402]
R28  value 1K  [R0402]
R29  value 1K  [R0402]
R30  value 1K  [R0402]
R31  value 240R  [R0402]
R32  value 10K  [R0402]
R33  value 1K  [R0402]
R34  value 33R  [R0402]
U2  NT5CC256M16ER-EK  [ICC_VFBGA96_9x13_P080]

### Ports
DDR_A_C (harness DDR_A_C), DDR_BYTE_0&1 (harness DDR_BYTE_0&1)

### Harnesses
DDR_BYTE_0&1: DDR_DQ8, DDR_DQ15, DDR_DQ9, DDR_DQ12, DDR_DQ13, DDR_DQ14, DDR_DQ10, DDR_DQ11, DDR_DQS1_P, DDR_DQS1_N, DDR_DQM1, DDR_DQ7, DDR_DQ4, DDR_DQ0, DDR_DQ5, DDR_DQ1, DDR_DQ6, DDR_DQ3, DDR_DQ2, DDR_DQS0_P, DDR_DQS0_N, DDR_DQM0
DDR_A_C: DDR_A4, DDR_A0, DDR_A2, DDR_A1, DDR_A6, DDR_A3, DDR_A5, DDR_A7, DDR_A8, DDR_A9, DDR_A14, DDR_A10, DDR_A12, DDR_A11, DDR_BA0, DDR_A13, DDR_BA1, DDR_BA2, DDR_RASN, DDR_CASN, DDR_CSN, DDR_CKE, DDR_WEN, DDR_ODT, DDR_CLK_P, DDR_CLK_N, DDR_RESETN, DDR_A15

### Nets
GND: C9.1 C10.1 C11.1 C12.1 C15.1 C16.1 C17.1 C19.1 C20.1 C21.1 C22.2 C23.1 C24.1 C25.1 C26.1 C27.1 C28.1 R14.1 R29.1 R31.1 R32.1 R33.1 U2.A9(VSS) U2.B1(VSSQ) U2.B3(VSS) U2.B9(VSSQ) U2.D1(VSSQ) U2.D8(VSSQ) U2.E1(VSS) U2.E2(VSSQ) U2.E8(VSSQ) U2.F9(VSSQ) U2.G1(VSSQ) U2.G8(VSS) U2.G9(VSSQ) U2.J2(VSS) U2.J8(VSS) U2.M1(VSS) U2.M9(VSS) U2.P1(VSS) U2.P9(VSS) U2.T1(VSS) U2.T9(VSS)
VDD_DDR: C9.2 C10.2 C11.2 C12.2 C15.2 C16.2 C17.2 C19.2 C20.2 C21.2 C22.1 C23.2 C24.2 C25.2 C27.2 R28.2 R30.2 U2.A1(VDDQ) U2.A8(VDDQ) U2.B2(VDD) U2.C1(VDDQ) U2.C9(VDDQ) U2.D2(VDDQ) U2.D9(VDD) U2.E9(VDDQ) U2.F1(VDDQ) U2.G7(VDD) U2.H2(VDDQ) U2.H9(VDDQ) U2.K2(VDD) U2.K8(VDD) U2.N1(VDD) U2.N9(VDD) U2.R1(VDD) U2.R9(VDD)
A0: R3.2 U2.N3(A0)
A1: R4.2 U2.P7(A1)
A2: R5.2 U2.P3(A2)
A3: R6.2 U2.N2(A3)
A4: R7.2 U2.P8(A4)
A5: R8.2 U2.P2(A5)
A6: R9.2 U2.R8(A6)
A7: R10.2 U2.R2(A7)
A8: R11.2 U2.T8(A8)
A9: R12.2 U2.R3(A9)
A10: R13.2 U2.L7(A10/AP)
A11: R15.2 U2.R7(A11)
A12: R16.2 U2.N7(A12/BC#)
A13: R17.2 U2.T3(A13)
A14: R18.2 U2.T7(A14)
A15: R34.2 U2.M7(A15)
BA0: R19.2 U2.M2(BA0)
BA1: R20.2 U2.N8(BA1)
BA2: R21.2 U2.M3(BA2)
CASN: R23.2 U2.K3(CAS#)
CKE: R14.2 R25.2 U2.K9(CKE)
CSN: R24.2 U2.L2(CS#)
DDR_A0: R3.1 ; port DDR_A_C.DDR_A0
DDR_A1: R4.1 ; port DDR_A_C.DDR_A1
DDR_A2: R5.1 ; port DDR_A_C.DDR_A2
DDR_A3: R6.1 ; port DDR_A_C.DDR_A3
DDR_A4: R7.1 ; port DDR_A_C.DDR_A4
DDR_A5: R8.1 ; port DDR_A_C.DDR_A5
DDR_A6: R9.1 ; port DDR_A_C.DDR_A6
DDR_A7: R10.1 ; port DDR_A_C.DDR_A7
DDR_A8: R11.1 ; port DDR_A_C.DDR_A8
DDR_A9: R12.1 ; port DDR_A_C.DDR_A9
DDR_A10: R13.1 ; port DDR_A_C.DDR_A10
DDR_A11: R15.1 ; port DDR_A_C.DDR_A11
DDR_A12: R16.1 ; port DDR_A_C.DDR_A12
DDR_A13: R17.1 ; port DDR_A_C.DDR_A13
DDR_A14: R18.1 ; port DDR_A_C.DDR_A14
DDR_A15: R34.1 ; port DDR_A_C.DDR_A15
DDR_BA0: R19.1 ; port DDR_A_C.DDR_BA0
DDR_BA1: R20.1 ; port DDR_A_C.DDR_BA1
DDR_BA2: R21.1 ; port DDR_A_C.DDR_BA2
DDR_CASN: R23.1 ; port DDR_A_C.DDR_CASN
DDR_CKE: R25.1 ; port DDR_A_C.DDR_CKE
DDR_CLK_N: R2.1 U2.K7(CK#) ; port DDR_A_C.DDR_CLK_N
DDR_CLK_P: R2.2 U2.J7(CK) ; port DDR_A_C.DDR_CLK_P
DDR_CSN: R24.1 ; port DDR_A_C.DDR_CSN
DDR_DQ0: U2.C8(DQU2) ; port DDR_BYTE_0&1.DDR_DQ0
DDR_DQ1: U2.A7(DQU4) ; port DDR_BYTE_0&1.DDR_DQ1
DDR_DQ2: U2.A3(DQU7) ; port DDR_BYTE_0&1.DDR_DQ2
DDR_DQ3: U2.B8(DQU6) ; port DDR_BYTE_0&1.DDR_DQ3
DDR_DQ4: U2.C3(DQU1) ; port DDR_BYTE_0&1.DDR_DQ4
DDR_DQ5: U2.C2(DQU3) ; port DDR_BYTE_0&1.DDR_DQ5
DDR_DQ6: U2.A2(DQU5) ; port DDR_BYTE_0&1.DDR_DQ6
DDR_DQ7: U2.D7(DQU0) ; port DDR_BYTE_0&1.DDR_DQ7
DDR_DQ8: U2.E3(DQL0) ; port DDR_BYTE_0&1.DDR_DQ8
DDR_DQ9: U2.F2(DQL2) ; port DDR_BYTE_0&1.DDR_DQ9
DDR_DQ10: U2.G2(DQL6) ; port DDR_BYTE_0&1.DDR_DQ10
DDR_DQ11: U2.H7(DQL7) ; port DDR_BYTE_0&1.DDR_DQ11
DDR_DQ12: U2.F8(DQL3) ; port DDR_BYTE_0&1.DDR_DQ12
DDR_DQ13: U2.H3(DQL4) ; port DDR_BYTE_0&1.DDR_DQ13
DDR_DQ14: U2.H8(DQL5) ; port DDR_BYTE_0&1.DDR_DQ14
DDR_DQ15: U2.F7(DQL1) ; port DDR_BYTE_0&1.DDR_DQ15
DDR_DQM0: U2.D3(DMU) ; port DDR_BYTE_0&1.DDR_DQM0
DDR_DQM1: U2.E7(DML) ; port DDR_BYTE_0&1.DDR_DQM1
DDR_DQS0_N: U2.B7(DQSU#) ; port DDR_BYTE_0&1.DDR_DQS0_N
DDR_DQS0_P: U2.C7(DQSU) ; port DDR_BYTE_0&1.DDR_DQS0_P
DDR_DQS1_N: U2.G3(DQSL#) ; port DDR_BYTE_0&1.DDR_DQS1_N
DDR_DQS1_P: U2.F3(DQSL) ; port DDR_BYTE_0&1.DDR_DQS1_P
DDR_ODT: R27.1 ; port DDR_A_C.DDR_ODT
DDR_RASN: R22.1 ; port DDR_A_C.DDR_RASN
DDR_RESETN: R32.2 U2.T2(RESET#) ; port DDR_A_C.DDR_RESETN
DDR_WEN: R26.1 ; port DDR_A_C.DDR_WEN
ODT: R27.2 U2.K1(ODT)
RASN: R22.2 U2.J3(RAS#)
WEN: R26.2 U2.L3(WE#)
NetC26_2: C26.2 R28.1 R29.2 U2.H1(VREFDQ)
NetC28_2: C28.2 R30.1 R33.2 U2.M8(VREFCA)
NetR31_2: R31.2 U2.L8(ZQ)

Not connected (* = marked no-connect by the designer): U2 J1(NC)* J9(NC)* L1(NC)* L9(NC)*

### Layout directives
differential pair: DDR_CLK_N, DDR_CLK_P, DDR_DQS0_N, DDR_DQS0_P, DDR_DQS1_N, DDR_DQS1_P

### Notes on the sheet
- To connect to VDD_DDR power plane
- 1%
- (near R31) 1%
- Title:
- Project:
- Size:
- Revision:
- Variant:
- A3
- -
- Date:
- Reference:
- Sheet:
- of

### Library data of the parts
C9-C12 C17 C19-C28 = MCD-00006: as C1 on sheet Power_MPU; Internal_Part_Number: MCD-00006; Status: Released; Part_Type: Capacitor; Package: C0402; ComponentLink1Description: Datasheet; ComponentLink1URL: http://tunmcdsvn.tun.st.com/Component_Datasheet_Library/Trunk/Capacitors/Yageo_Multilayer_Capacitor_X7R_series_100pF_to_22uF
C15 C16 = MCD-00099: as C18 on sheet Power_PMIC; Internal_Part_Number: MCD-00099; Status: Released; Part_Type: Capacitor; Package: C0603; ComponentLink1Description: Datasheet; ComponentLink1URL: http://tunmcdsvn.tun.st.com/Component_Datasheet_Library/Trunk/Capacitors/Murata_Capacitor_GR_series
R2 = MCD-00119: Resistor,100R,0402,1%,1/16W; Manufacturer_Part_Number: RC0402FR-07100RL; Manufacturer: YAGEO; Provided_By: SUBCO; ECCN_US: EAR99; ECCN_EU: NEC; Internal_Part_Number: MCD-00119; Status: Released; Part_Type: Resistor; Package: R0402; ComponentLink1Description: Datasheet; ComponentLink1URL: http://tunmcdsvn.tun.st.com/Component_Datasheet_Library/Trunk/Resistors/Yageo_Resistor_RC0402-series
R3-R13 R15-R27 R34 = MCD-00455: Resistor,33R,0402,1%,1/16W; Manufacturer_Part_Number: RC0402FR-0733RL; Manufacturer: YAGEO; Provided_By: SUBCO; ECCN_US: EAR99; ECCN_EU: NEC; Internal_Part_Number: MCD-00455; Status: Released; ComponentLink1Description: Datasheet; Part_Type: Resistor; Package: R0402; ComponentLink1URL: http://tunmcdsvn.tun.st.com/Component_Datasheet_Library/Trunk/Resistors/Yageo_Resistor_RC0402-series
R14 R32 = MCD-00053: as R40 on sheet eMMC; Internal_Part_Number: MCD-00053; Status: Released; ComponentLink1Description: Datasheet; Part_Type: Resistor; Package: R0402; ComponentLink1URL: http://tunmcdsvn.tun.st.com/Component_Datasheet_Library/Trunk/Resistors/Yageo_Resistor_RC0402-series
R28-R30 R33 = MCD-00061: Resistor,1K,0402,1%,1/16W; Manufacturer_Part_Number: RC0402FR-071KL; Manufacturer: YAGEO; Provided_By: SUBCO; ECCN_US: EAR99; ECCN_EU: NEC; Internal_Part_Number: MCD-00061; Status: Released; Part_Type: Resistor; Package: R0402; ComponentLink1Description: Datasheet; ComponentLink1URL: http://tunmcdsvn.tun.st.com/Component_Datasheet_Library/Trunk/Resistors/Yageo_Resistor_RC0402-series
R31 = MCD-00120: Resistor,240R,0402,1%,1/16W; Manufacturer_Part_Number: RC0402FR-07240RL; Manufacturer: YAGEO; Provided_By: SUBCO; ECCN_US: EAR99; ECCN_EU: NEC; Internal_Part_Number: MCD-00120; Status: Released; ComponentLink1Description: Datasheet; Part_Type: Resistor; Package: R0402; ComponentLink1URL: http://tunmcdsvn.tun.st.com/Component_Datasheet_Library/Trunk/Resistors/Yageo_Resistor_RC0402-series
U2 = MCD-01811: Memory,DDR3L,4Gb,256Mbx16,933Mhz,1V35,TFBGA; Part_Type: IC; Manufacturer: NANYA; ECCN_US: tbd; Provided_By: SUBCO; Internal_Part_Number: MCD-01811; Value: NT5CC256M16ER-EK; Status: Released; Manufacturer_Part_Number: NT5CC256M16ER-EK; ComponentLink1Description: Datasheet; ComponentLink1URL: http://tunmcdsvn.tun.st.com/Component_Datasheet_Library/Trunk/IC/Nanya_DDR3_NT5CC256M16ER-EK; ECCN_EU: tbd

## Sheet STM32_MPU_IOs.SchDoc: MPU
size A3; SheetNumber: 3; SheetTotal: 7
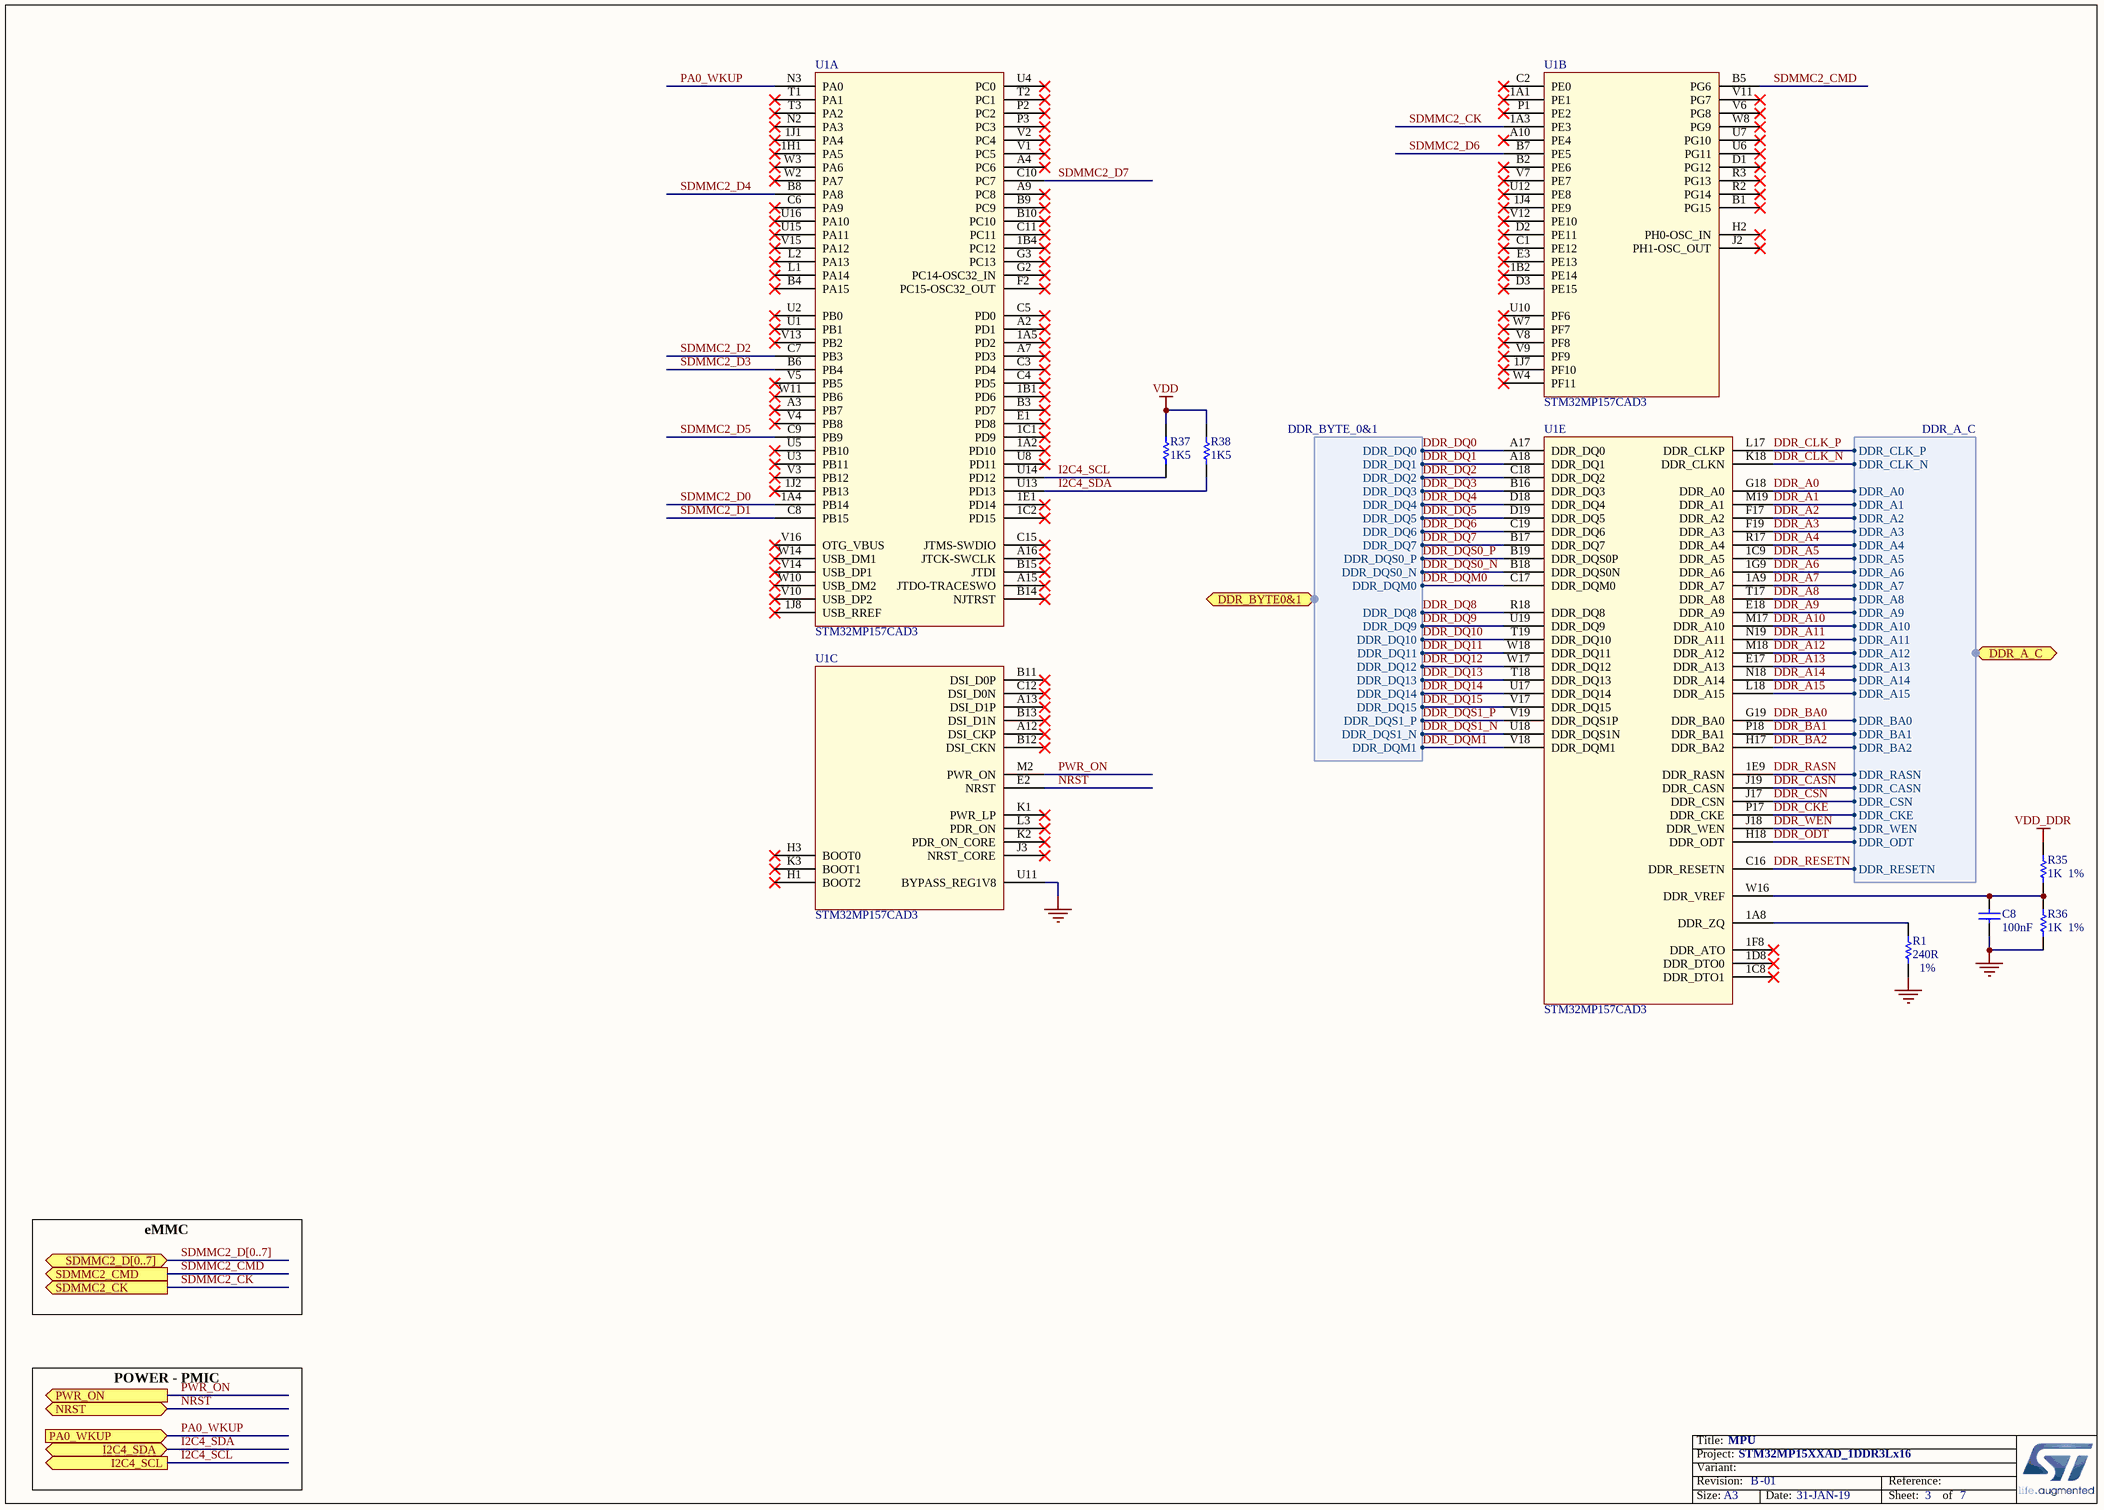
[diagram p6: STM32_MPU_IOs.SchDoc]

### Parts
C8  value 100nF  [C0402]
R1  value 240R  [R0402]
R35  value 1K  [R0402]
R36  value 1K  [R0402]
R37  value 1K5  [R0402]
R38  value 1K5  [R0402]
U1  value STM32MP157CAD3  [ICC_TFBGA257_10X10_STM32MP157CAD3_P050-065]  (parts A,B,C,E of 5)

### Ports
DDR_A_C (harness DDR_A_C), DDR_BYTE0&1 (harness DDR_BYTE_0&1), I2C4_SCL (out), I2C4_SDA (bidir), NRST (bidir), PA0_WKUP (in), PWR_ON (out), SDMMC2_CK (out), SDMMC2_CMD (out), SDMMC2_D[0..7] (bidir)

### Harnesses
DDR_BYTE_0&1: DDR_DQ0, DDR_DQ1, DDR_DQ2, DDR_DQ3, DDR_DQ4, DDR_DQ5, DDR_DQ6, DDR_DQ7, DDR_DQS0_P, DDR_DQS0_N, DDR_DQM0, DDR_DQ8, DDR_DQ9, DDR_DQ10, DDR_DQ11, DDR_DQ12, DDR_DQ13, DDR_DQ14, DDR_DQ15, DDR_DQS1_P, DDR_DQS1_N, DDR_DQM1
DDR_A_C: DDR_CLK_P, DDR_CLK_N, DDR_A0, DDR_A1, DDR_A2, DDR_A3, DDR_A4, DDR_A5, DDR_A6, DDR_A7, DDR_A8, DDR_A9, DDR_A10, DDR_A11, DDR_A12, DDR_A13, DDR_A14, DDR_BA0, DDR_BA1, DDR_BA2, DDR_RASN, DDR_CASN, DDR_CSN, DDR_CKE, DDR_WEN, DDR_ODT, DDR_RESETN, DDR_A15

### Nets
GND: C8.1 R1.1 R36.1 U1.U11(BYPASS_REG1V8)
VDD: R37.1 R38.1
VDD_DDR: R35.2
DDR_A0: U1.G18(DDR_A0) ; port DDR_A_C.DDR_A0
DDR_A1: U1.M19(DDR_A1) ; port DDR_A_C.DDR_A1
DDR_A2: U1.F17(DDR_A2) ; port DDR_A_C.DDR_A2
DDR_A3: U1.F19(DDR_A3) ; port DDR_A_C.DDR_A3
DDR_A4: U1.R17(DDR_A4) ; port DDR_A_C.DDR_A4
DDR_A5: U1.1C9(DDR_A5) ; port DDR_A_C.DDR_A5
DDR_A6: U1.1G9(DDR_A6) ; port DDR_A_C.DDR_A6
DDR_A7: U1.1A9(DDR_A7) ; port DDR_A_C.DDR_A7
DDR_A8: U1.T17(DDR_A8) ; port DDR_A_C.DDR_A8
DDR_A9: U1.E18(DDR_A9) ; port DDR_A_C.DDR_A9
DDR_A10: U1.M17(DDR_A10) ; port DDR_A_C.DDR_A10
DDR_A11: U1.N19(DDR_A11) ; port DDR_A_C.DDR_A11
DDR_A12: U1.M18(DDR_A12) ; port DDR_A_C.DDR_A12
DDR_A13: U1.E17(DDR_A13) ; port DDR_A_C.DDR_A13
DDR_A14: U1.N18(DDR_A14) ; port DDR_A_C.DDR_A14
DDR_A15: U1.L18(DDR_A15) ; port DDR_A_C.DDR_A15
DDR_BA0: U1.G19(DDR_BA0) ; port DDR_A_C.DDR_BA0
DDR_BA1: U1.P18(DDR_BA1) ; port DDR_A_C.DDR_BA1
DDR_BA2: U1.H17(DDR_BA2) ; port DDR_A_C.DDR_BA2
DDR_CASN: U1.J19(DDR_CASN) ; port DDR_A_C.DDR_CASN
DDR_CKE: U1.P17(DDR_CKE) ; port DDR_A_C.DDR_CKE
DDR_CLK_N: U1.K18(DDR_CLKN) ; port DDR_A_C.DDR_CLK_N
DDR_CLK_P: U1.L17(DDR_CLKP) ; port DDR_A_C.DDR_CLK_P
DDR_CSN: U1.J17(DDR_CSN) ; port DDR_A_C.DDR_CSN
DDR_DQ0: U1.A17(DDR_DQ0) ; port DDR_BYTE0&1.DDR_DQ0
DDR_DQ1: U1.A18(DDR_DQ1) ; port DDR_BYTE0&1.DDR_DQ1
DDR_DQ2: U1.C18(DDR_DQ2) ; port DDR_BYTE0&1.DDR_DQ2
DDR_DQ3: U1.B16(DDR_DQ3) ; port DDR_BYTE0&1.DDR_DQ3
DDR_DQ4: U1.D18(DDR_DQ4) ; port DDR_BYTE0&1.DDR_DQ4
DDR_DQ5: U1.D19(DDR_DQ5) ; port DDR_BYTE0&1.DDR_DQ5
DDR_DQ6: U1.C19(DDR_DQ6) ; port DDR_BYTE0&1.DDR_DQ6
DDR_DQ7: U1.B17(DDR_DQ7) ; port DDR_BYTE0&1.DDR_DQ7
DDR_DQ8: U1.R18(DDR_DQ8) ; port DDR_BYTE0&1.DDR_DQ8
DDR_DQ9: U1.U19(DDR_DQ9) ; port DDR_BYTE0&1.DDR_DQ9
DDR_DQ10: U1.T19(DDR_DQ10) ; port DDR_BYTE0&1.DDR_DQ10
DDR_DQ11: U1.W18(DDR_DQ11) ; port DDR_BYTE0&1.DDR_DQ11
DDR_DQ12: U1.W17(DDR_DQ12) ; port DDR_BYTE0&1.DDR_DQ12
DDR_DQ13: U1.T18(DDR_DQ13) ; port DDR_BYTE0&1.DDR_DQ13
DDR_DQ14: U1.U17(DDR_DQ14) ; port DDR_BYTE0&1.DDR_DQ14
DDR_DQ15: U1.V17(DDR_DQ15) ; port DDR_BYTE0&1.DDR_DQ15
DDR_DQM0: U1.C17(DDR_DQM0) ; port DDR_BYTE0&1.DDR_DQM0
DDR_DQM1: U1.V18(DDR_DQM1) ; port DDR_BYTE0&1.DDR_DQM1
DDR_DQS0_N: U1.B18(DDR_DQS0N) ; port DDR_BYTE0&1.DDR_DQS0_N
DDR_DQS0_P: U1.B19(DDR_DQS0P) ; port DDR_BYTE0&1.DDR_DQS0_P
DDR_DQS1_N: U1.U18(DDR_DQS1N) ; port DDR_BYTE0&1.DDR_DQS1_N
DDR_DQS1_P: U1.V19(DDR_DQS1P) ; port DDR_BYTE0&1.DDR_DQS1_P
DDR_ODT: U1.H18(DDR_ODT) ; port DDR_A_C.DDR_ODT
DDR_RASN: U1.1E9(DDR_RASN) ; port DDR_A_C.DDR_RASN
DDR_RESETN: U1.C16(DDR_RESETN) ; port DDR_A_C.DDR_RESETN
DDR_WEN: U1.J18(DDR_WEN) ; port DDR_A_C.DDR_WEN
I2C4_SCL: R37.2 U1.U14(PD12) ; port I2C4_SCL
I2C4_SDA: R38.2 U1.U13(PD13) ; port I2C4_SDA
NRST: U1.E2(NRST) ; port NRST
PA0_WKUP: U1.N3(PA0) ; port PA0_WKUP
PWR_ON: U1.M2(PWR_ON) ; port PWR_ON
SDMMC2_CK: U1.1A3(PE3) ; port SDMMC2_CK
SDMMC2_CMD: U1.B5(PG6) ; port SDMMC2_CMD
SDMMC2_D0: U1.1A4(PB14)
SDMMC2_D1: U1.C8(PB15)
SDMMC2_D2: U1.C7(PB3)
SDMMC2_D3: U1.B6(PB4)
SDMMC2_D4: U1.B8(PA8)
SDMMC2_D5: U1.C9(PB9)
SDMMC2_D6: U1.B7(PE5)
SDMMC2_D7: U1.C10(PC7)
NetC8_2: C8.2 R35.1 R36.2 U1.W16(DDR_VREF)
NetR1_2: R1.2 U1.1A8(DDR_ZQ)

Not connected (* = marked no-connect by the designer): U1 1A1(PE1)* 1A2(PD10)* 1A5(PD2)* 1B1(PD6)* 1B2(PE14)* 1B4(PC12)* 1C1(PD9)* 1C2(PD15)* 1C8(DDR_DTO1)* 1D8(DDR_DTO0)* 1E1(PD14)* 1F8(DDR_ATO)* 1H1(PA5)* 1J1(PA4)* 1J2(PB13)* 1J4(PE9)* 1J7(PF10)* 1J8(USB_RREF)* A2(PD1)* A3(PB7)* A4(PC6)* A7(PD3)* A9(PC8)* A10(PE4)* A12(DSI_CKP)* A13(DSI_D1P)* A15(JTDO-TRACESWO)* A16(JTCK-SWCLK)* B1(PG15)* B2(PE6)* B3(PD7)* B4(PA15)* B9(PC9)* B10(PC10)* B11(DSI_D0P)* B12(DSI_CKN)* B13(DSI_D1N)* B14(NJTRST)* B15(JTDI)* C1(PE12)* C2(PE0)* C3(PD4)* C4(PD5)* C5(PD0)* C6(PA9)* C11(PC11)* C12(DSI_D0N)* C15(JTMS-SWDIO)* D1(PG12)* D2(PE11)* D3(PE15)* E1(PD8)* E3(PE13)* F2(PC15-OSC32_OUT)* G2(PC14-OSC32_IN)* G3(PC13)* H1(BOOT2)* H2(PH0-OSC_IN)* H3(BOOT0)* J2(PH1-OSC_OUT)* J3(NRST_CORE)* K1(PWR_LP)* K2(PDR_ON_CORE)* K3(BOOT1)* L1(PA14)* L2(PA13)* L3(PDR_ON)* N2(PA3)* P1(PE2)* P2(PC2)* P3(PC3)* R2(PG14)* R3(PG13)* T1(PA1)* T2(PC1)* T3(PA2)* U1(PB1)* U2(PB0)* U3(PB11)* U4(PC0)* U5(PB10)* U6(PG11)* U7(PG10)* U8(PD11)* U10(PF6)* U12(PE8)* U15(PA11)* U16(PA10)* V1(PC5)* V2(PC4)* V3(PB12)* V4(PB8)* V5(PB5)* V6(PG8)* V7(PE7)* V8(PF8)* V9(PF9)* V10(USB_DP2)* V11(PG7)* V12(PE10)* V13(PB2)* V14(USB_DP1)* V15(PA12)* V16(OTG_VBUS)* W2(PA7)* W3(PA6)* W4(PF11)* W7(PF7)* W8(PG9)* W10(USB_DM2)* W11(PB6)* W14(USB_DM1)*

### Buses and harness runs
bus SDMMC2_D[0..7] = port SDMMC2_D[0..7]

### Notes on the sheet
- 1%
- (near R1) 1%
- (near R36) 1%
- eMMC
- POWER - PMIC
- Title:
- Project:
- Size:
- Revision:
- Variant:
- A3
- -
- Date:
- Reference:
- Sheet:
- of

### Library data of the parts
C8 = MCD-00006: as C1 on sheet Power_MPU; Internal_Part_Number: MCD-00006; Status: Released; Part_Type: Capacitor; Package: C0402; ComponentLink1Description: Datasheet; ComponentLink1URL: http://tunmcdsvn.tun.st.com/Component_Datasheet_Library/Trunk/Capacitors/Yageo_Multilayer_Capacitor_X7R_series_100pF_to_22uF
R1 = MCD-00120: as R31 on sheet 1DDR3L_16bits; Internal_Part_Number: MCD-00120; Status: Released; Part_Type: Resistor; Package: R0402; ComponentLink1Description: Datasheet; ComponentLink1URL: http://tunmcdsvn.tun.st.com/Component_Datasheet_Library/Trunk/Resistors/Yageo_Resistor_RC0402-series
R35 R36 = MCD-00061: as R28 on sheet 1DDR3L_16bits; Internal_Part_Number: MCD-00061; Status: Released; Part_Type: Resistor; Package: R0402; ComponentLink1Description: Datasheet; ComponentLink1URL: http://tunmcdsvn.tun.st.com/Component_Datasheet_Library/Trunk/Resistors/Yageo_Resistor_RC0402-series
R37 R38 = MCD-00068: Resistor,1K5,0402,1%,1/16W; Manufacturer_Part_Number: RC0402FR-071K5L; Manufacturer: YAGEO; Provided_By: SUBCO; ECCN_US: EAR99; ECCN_EU: NEC; Internal_Part_Number: MCD-00068; ComponentLink1Description: Datasheet; Status: Released; Part_Type: Resistor; ComponentLink1URL: http://tunmcdsvn.tun.st.com/Component_Datasheet_Library/Trunk/Resistors/Yageo_Resistor_RC0402-series; Package: R0402
U1 = MCD-01144: MPU TFBGA10x10 secure boot+crypto; Part_Type: IC; Manufacturer: STMICROELECTRONICS; Provided_By: SUBCO with ST control; ECCN_US: 5A002A4; Internal_Part_Number: MCD-01144; Status: Footprint available; Manufacturer_Part_Number: STM32MP157CAD3; ComponentLink1Description: Datasheet; ComponentLink1URL: http://TBD; ECCN_EU: 5A002A4

## Nets that join several sheets
3V3: Power_PMIC (5 pins), eMMC (6 pins)
GND: Power_PMIC (26 pins), Power_MPU (68 pins), eMMC (17 pins), 1DDR3L_16bits (43 pins), STM32_MPU_IOs (C8.1 R1.1 R36.1 U1.U11)
VDD: Power_PMIC (C38.2 L3.2 U4.31 U4.42), Power_MPU (11 pins), eMMC (8 pins), STM32_MPU_IOs (R37.1 R38.1)
VDD_CORE: Power_PMIC (C34.2 L1.2 U4.5), Power_MPU (20 pins)
VDD_DDR: Power_PMIC (5 pins), Power_MPU (11 pins), 1DDR3L_16bits (35 pins), STM32_MPU_IOs (R35.2)
VDD_USB: Power_PMIC (C52.2 U4.39), Power_MPU (C7.2 U1.1H7)
VDDA: Power_PMIC (C49.2 U4.20), Power_MPU (R42.1)
DDR_A0: 1DDR3L_16bits (R3.1), STM32_MPU_IOs (U1.G18)
DDR_A1: 1DDR3L_16bits (R4.1), STM32_MPU_IOs (U1.M19)
DDR_A2: 1DDR3L_16bits (R5.1), STM32_MPU_IOs (U1.F17)
DDR_A3: 1DDR3L_16bits (R6.1), STM32_MPU_IOs (U1.F19)
DDR_A4: 1DDR3L_16bits (R7.1), STM32_MPU_IOs (U1.R17)
DDR_A5: 1DDR3L_16bits (R8.1), STM32_MPU_IOs (U1.1C9)
DDR_A6: 1DDR3L_16bits (R9.1), STM32_MPU_IOs (U1.1G9)
DDR_A7: 1DDR3L_16bits (R10.1), STM32_MPU_IOs (U1.1A9)
DDR_A8: 1DDR3L_16bits (R11.1), STM32_MPU_IOs (U1.T17)
DDR_A9: 1DDR3L_16bits (R12.1), STM32_MPU_IOs (U1.E18)
DDR_A10: 1DDR3L_16bits (R13.1), STM32_MPU_IOs (U1.M17)
DDR_A11: 1DDR3L_16bits (R15.1), STM32_MPU_IOs (U1.N19)
DDR_A12: 1DDR3L_16bits (R16.1), STM32_MPU_IOs (U1.M18)
DDR_A13: 1DDR3L_16bits (R17.1), STM32_MPU_IOs (U1.E17)
DDR_A14: 1DDR3L_16bits (R18.1), STM32_MPU_IOs (U1.N18)
DDR_A15: 1DDR3L_16bits (R34.1), STM32_MPU_IOs (U1.L18)
DDR_BA0: 1DDR3L_16bits (R19.1), STM32_MPU_IOs (U1.G19)
DDR_BA1: 1DDR3L_16bits (R20.1), STM32_MPU_IOs (U1.P18)
DDR_BA2: 1DDR3L_16bits (R21.1), STM32_MPU_IOs (U1.H17)
DDR_CASN: 1DDR3L_16bits (R23.1), STM32_MPU_IOs (U1.J19)
DDR_CKE: 1DDR3L_16bits (R25.1), STM32_MPU_IOs (U1.P17)
DDR_CLK_N: 1DDR3L_16bits (R2.1 U2.K7), STM32_MPU_IOs (U1.K18)
DDR_CLK_P: 1DDR3L_16bits (R2.2 U2.J7), STM32_MPU_IOs (U1.L17)
DDR_CSN: 1DDR3L_16bits (R24.1), STM32_MPU_IOs (U1.J17)
DDR_ODT: 1DDR3L_16bits (R27.1), STM32_MPU_IOs (U1.H18)
DDR_RASN: 1DDR3L_16bits (R22.1), STM32_MPU_IOs (U1.1E9)
DDR_RESETN: 1DDR3L_16bits (R32.2 U2.T2), STM32_MPU_IOs (U1.C16)
DDR_WEN: 1DDR3L_16bits (R26.1), STM32_MPU_IOs (U1.J18)
I2C4_SCL: Power_PMIC (U4.4), STM32_MPU_IOs (R37.2 U1.U14)
I2C4_SDA: Power_PMIC (U4.3), STM32_MPU_IOs (R38.2 U1.U13)
NRST: Power_PMIC (U4.1), STM32_MPU_IOs (U1.E2)
PA0_WKUP: Power_PMIC (U4.43), STM32_MPU_IOs (U1.N3)
PWR_ON: Power_PMIC (U4.44), STM32_MPU_IOs (U1.M2)

## Assembly variants
Example: not fitted R34 R42